# EAGLE design Tester Charger Mk2 (EAGLE 9.6.2)
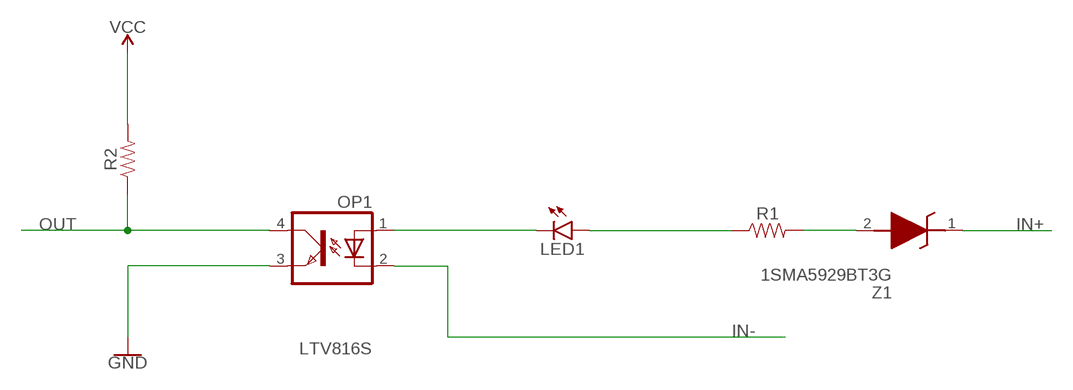
[diagram p0: schematic, sheet 1]

## Parts
LED1  LED3MM  [LED3MM]
OP1  LTV816S  [SMD4]
R1  RESISTOR0805  [0805]
R2  RESISTOR0805  [0805]
Z1  1SMA5929BT3G  [DIOM5226X220N]

## Nets
GND: OP1.3(EMIT)
IN+: Z1.1(K)
IN-: OP1.2(C)
N$1: LED1.K(C) OP1.1(A)
N$2: R1.2 Z1.2(A)
N$3: LED1.A R1.1
OUT: OP1.4(COL) R2.1
VCC: R2.2

## Library data of the parts
LED1 = SparkFun-LED:LED: LEDs Standard schematic elements and footprints for 5mm, 3mm, 1206, and 0603 sized LEDs. 5mm - Spark Fun Electronics SKU : COM-00529 (and others)
OP1 = optocoupler:LTV816: OPTO COUPLER Source: LITEON, LTV816.pdf; OC_FARNELL: unknown; OC_NEWARK: unknown
R1 R2 = SparkFun-Resistors:RESISTOR: Generic Resistor Package
Z1 = 1SMA5929BT3G:1SMA5929BT3G: ON SEMICONDUCTOR - 1SMA5929BT3G - DIODE, ZENER, 15V, 1.5W Source: Datasheet <http://www.onsemi.com/pub/Collateral/1SMA5913BT3-D.PDF>; ARROW_PART_NUMBER: 1SMA5929BT3G; ARROW_PRICE-STOCK: https://www.arrow.com/en/products/1sma5929bt3g/on-semiconductor; DESCRIPTION: ON SEMICONDUCTOR - 1SMA5929BT3G - DIODE, ZENER, 15V, 1.5W; HEIGHT: 2.2mm; MANUFACTURER_NAME: onsemi; MANUFACTURER_PART_NUMBER: 1SMA5929BT3G; MOUSER_PART_NUMBER: 863-1SMA5929BT3G; MOUSER_PRICE-STOCK: https://www.mouser.co.uk/ProductDetail/onsemi/1SMA5929BT3G?qs=y2kkmE52mdOX%2FLAlysPNvA%3D%3D

## Board
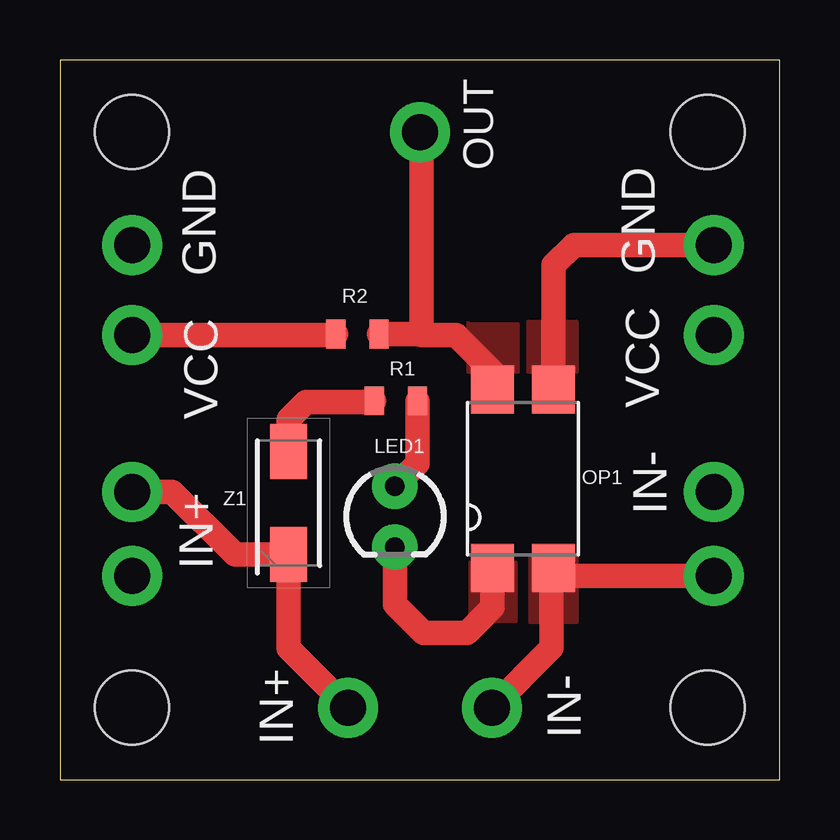
[diagram p1: board, top side]
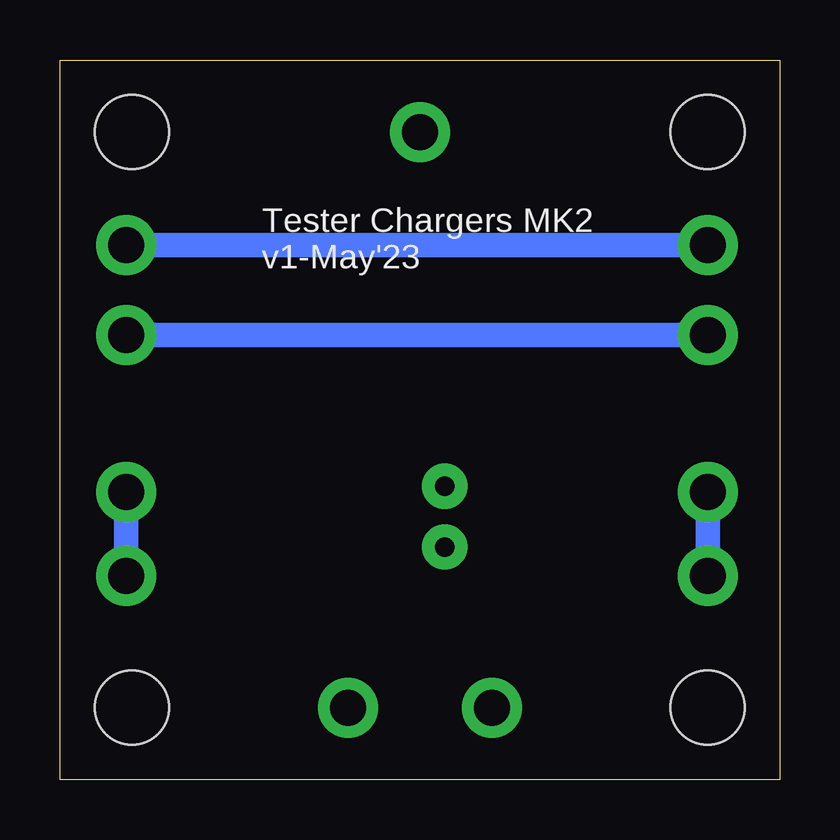
[diagram p2: board, bottom side, seen from below]

Size 30 x 30 mm. Coordinates in mm from the lower left corner, seen from the top.
Outline: 0,0 30,0 30,30 0,30 0,0
Copper layers (1*16): Top 0.035mm / dielectric 1.5mm / Bottom 0.035mm
Design rules "default": minimum track width 6mil, minimum drill 0.35mm, track to track 6mil, track to pad 6mil, pad to pad 6mil, via to via 6mil, smd to smd 6mil, copper to edge 40mil, drill to drill 6mil, minimum pad ring 10mil, minimum via ring 8mil, stop-mask expansion 4mil, vias tented up to drill 0mil, thermal gap 10mil
Holes 3.1 mm at 3,3 27,3 27,27 3,27

### Footprints (pad centres in the part's own frame; a part is rotated, then mirrored left to right if it is on the bottom)
LED3MM = drill 0.813 pad 1.88: A -1.27,0; K 1.27,0
SMD4 = smd 1.78 x 2: 1 -1.27,-3.725; 2 1.27,-3.725; 3 1.27,3.725; 4 -1.27,3.725
0805 = smd 0.8 x 1.2: 1 -0.9,0; 2 0.9,0
DIOM5226X220N = smd 2.3 x 1.55: 1 -2.15,0; 2 2.15,0

### Placement (x,y rotation side)
LED1  13.96,10.96 270 top
OP1  19.3,12.54 0 top
R1  14,15.79 180 top
R2  12.4,18.57 180 top
Z1  9.53,11.53 90 top

### Tracks (layer width: path | path; a pad name or v marks a point on that pad's centre or on a via)
GND  (via drill 1.5 pad 2.5)
  Top 1.016: OP1.3 20.57,21.44 21.42,22.29 v27.25,22.29
  Bottom 1.016: v3,22.29 v27.25,22.29
  pour Top (no thermals): 19.5,19.1 19.5,17 21.55,17 21.55,19.1
IN+  (via drill 1.5 pad 2.5)
  Top 1.016: v3,12 4.68,12 7.3,9.38 Z1.1 9.53,5.47 v12,3
  Bottom 1.016: v3,12 v3,8.5
IN-  (via drill 1.5 pad 2.5)
  Top 1.016: v18,3 20.49,5.49 20.49,8.56 20.55,8.5 | OP1.2 20.57,8.5 v27.25,8.5
  Bottom 1.016: v27.25,12 v27.25,8.5
  pour Top (no thermals): 19.6,9.25 19.6,6.55 19.75,6.55 21.55,6.55 21.55,9.35 19.6,9.35 19.6,9.3
N$1
  Top 1.016: LED1.K 13.96,7.3 15.15,6.11 16.96,6.11 18.03,7.18 OP1.1
  pour Top (no thermals): 17.1,9.05 17.1,6.65 17,6.65 17,6.6 19,6.6 19,9.05
N$2
  Top 1.016: Z1.2 9.53,15.02 10.26,15.75 12.76,15.75 R1.2
N$3
  Top 1.016: LED1.A 14.9,13.17 R1.1
OUT  (via drill 1.5 pad 2.5)
  Top 1.016: R2.1 15.07,18.57 | OP1.4 18.03,17.02 16.5,18.54 15.07,18.54 15.07,18.57 | 15.07,18.57 15.07,18.78 15.07,26.93 v15,27
  pour Top (no thermals): 17,19.05 17,17 19.1,17 19.1,19 18.95,19 17.05,19
VCC  (via drill 1.5 pad 2.5)
  Top 1.016: R2.2 11.47,18.54 v3,18.54
  Bottom 1.016: v27.25,18.54 v3,18.54

### Text on the board
tNames: OUT | GND | GND | VCC | VCC | IN- | IN+ | IN+ | IN-
bNames: Tester Chargers MK2 / v1-May'23